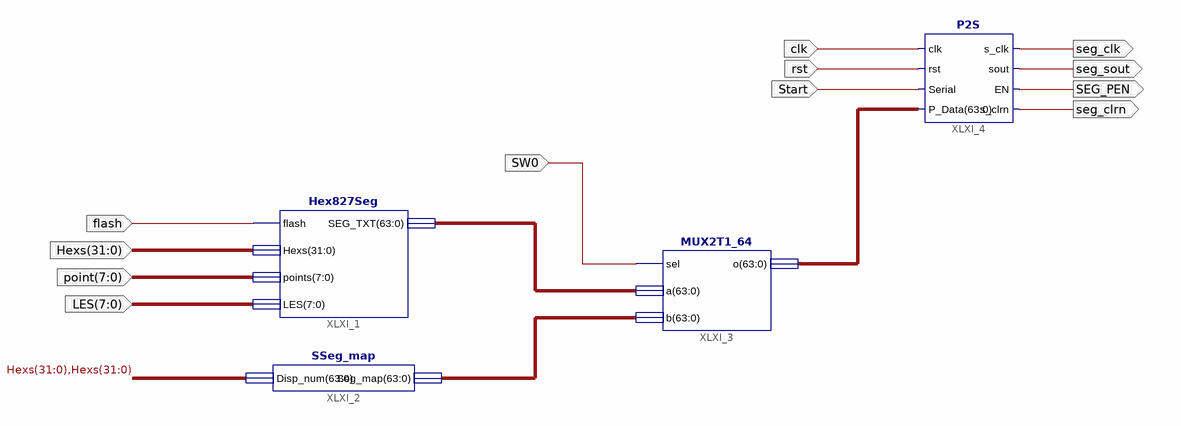
[diagram p0: schematic sheet 1]
// Xilinx ISE schematic Display.sch (kintex7) as structural Verilog: 4 symbols, 12 ports
module Display (
  input  flash,
  input  [31:0] Hexs,
  input  [7:0] point,
  input  [7:0] LES,
  input  SW0,
  input  Start,
  input  rst,
  input  clk,
  output seg_clrn,
  output SEG_PEN,
  output seg_sout,
  output seg_clk
);

  wire [63:0] XLXN_7, XLXN_9, XLXN_15;

  Hex827Seg XLXI_1 (.flash(flash), .Hexs(Hexs), .points(point), .LES(LES), .SEG_TXT(XLXN_15));
  SSeg_map XLXI_2 (.Disp_num({Hexs, Hexs}), .Seg_map(XLXN_7));
  MUX2T1_64 XLXI_3 (.sel(SW0), .a(XLXN_15), .b(XLXN_7), .o(XLXN_9));
  P2S XLXI_4 (
    .s_clrn(seg_clrn), .sout(seg_sout), .rst(rst), .EN(SEG_PEN), .Serial(Start), .clk(clk), .s_clk(seg_clk),
    .P_Data(XLXN_9));
endmodule
